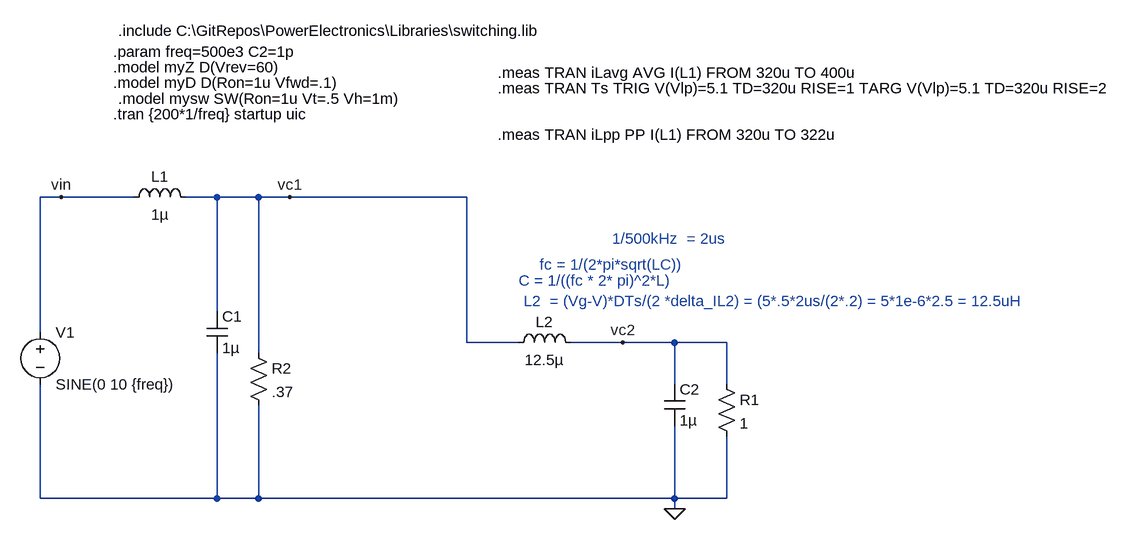
[diagram p0: schematic problem2-9_2.asc]
problem2-9_2.asc, the LTspice schematic file:
Version 4
SHEET 1 1140 724
WIRE -544 32 -576 32
WIRE -432 32 -544 32
WIRE -304 32 -352 32
WIRE -240 32 -304 32
WIRE -192 32 -240 32
WIRE 80 32 -192 32
WIRE -304 208 -304 32
WIRE -576 240 -576 32
WIRE 80 256 80 32
WIRE 160 256 80 256
WIRE 320 256 240 256
WIRE 400 256 320 256
WIRE 480 256 400 256
WIRE -240 272 -240 32
WIRE 400 320 400 256
WIRE 480 320 480 256
WIRE -576 496 -576 320
WIRE -304 496 -304 272
WIRE -304 496 -576 496
WIRE -240 496 -240 352
WIRE -240 496 -304 496
WIRE 400 496 400 384
WIRE 400 496 -240 496
WIRE 480 496 480 400
WIRE 480 496 400 496
WIRE 400 512 400 496
FLAG 400 512 0
FLAG -544 32 vin
FLAG 320 256 vc2
FLAG -192 32 vc1
SYMBOL res 464 304 R0
SYMATTR InstName R1
SYMATTR Value 1
SYMBOL ind -448 48 R270
WINDOW 0 32 56 VTop 2
WINDOW 3 5 56 VBottom 2
SYMATTR InstName L1
SYMATTR Value 1µ
SYMATTR SpiceLine Rser=1m Rpar=1Meg
SYMBOL voltage -576 224 R0
WINDOW 123 0 0 Left 0
WINDOW 39 0 0 Left 0
SYMATTR InstName V1
SYMATTR Value SINE(0 10 {freq})
SYMBOL cap 384 320 R0
SYMATTR InstName C2
SYMATTR Value 1µ
SYMBOL cap -320 208 R0
SYMATTR InstName C1
SYMATTR Value 1µ
SYMBOL ind 144 272 R270
WINDOW 0 32 56 VTop 2
WINDOW 3 5 56 VBottom 2
SYMATTR InstName L2
SYMATTR Value 12.5µ
SYMBOL res -256 256 R0
SYMATTR InstName R2
SYMATTR Value .37
TEXT -456 -120 Left 2 !.model mysw SW(Ron=1u Vt=.5 Vh=1m)
TEXT -464 -96 Left 2 !.tran {200*1/freq} startup uic
TEXT -456 -224 Left 2 !.include C:\\GitRepos\\PowerElectronics\\Libraries\\switching.lib
TEXT -464 -192 Left 2 !.param freq=500e3 C2=1p
TEXT 128 -160 Left 2 !.meas TRAN iLavg AVG I(L1) FROM 320u TO 400u
TEXT 128 -136 Left 2 !.meas TRAN Ts TRIG V(Vlp)=5.1 TD=320u RISE=1 TARG V(Vlp)=5.1 TD=320u RISE=2
TEXT 128 -64 Left 2 !.meas TRAN iLpp PP I(L1) FROM 320u TO 322u
TEXT -464 -144 Left 2 !.model myD D(Ron=1u Vfwd=.1)
TEXT 192 136 Left 2 ;fc = 1/(2*pi*sqrt(LC))
TEXT 160 160 Left 2 ;C = 1/((fc * 2* pi)^2*L)
TEXT -464 -168 Left 2 !.model myZ D(Vrev=60)
TEXT 304 96 Left 2 ;1/500kHz  = 2us
TEXT 168 192 Left 2 ;L2  = (Vg-V)*DTs/(2 *delta_IL2) = (5*.5*2us/(2*.2) = 5*1e-6*2.5 = 12.5uH

The netlist it stands for:
* problem2-9_2.asc
R1 vc2 0 1
L1 vin vc1 1µ Rser=1m Rpar=1Meg
V1 vin 0 SINE(0 10 {freq})
C2 vc2 0 1µ
C1 vc1 0 1µ
L2 vc1 vc2 12.5µ
R2 vc1 0 .37
.model mysw SW(Ron=1u Vt=.5 Vh=1m)
.tran {200*1/freq} startup uic
.include C:\GitRepos\PowerElectronics\Libraries\switching.lib
.param freq=500e3 C2=1p
.meas TRAN iLavg AVG I(L1) FROM 320u TO 400u
.meas TRAN Ts TRIG V(Vlp)=5.1 TD=320u RISE=1 TARG V(Vlp)=5.1 TD=320u RISE=2
.meas TRAN iLpp PP I(L1) FROM 320u TO 322u
.model myD D(Ron=1u Vfwd=.1)
* fc = 1/(2*pi*sqrt(LC))
* C = 1/((fc * 2* pi)^2*L)
.model myZ D(Vrev=60)
* 1/500kHz  = 2us
* L2  = (Vg-V)*DTs/(2 *delta_IL2) = (5*.5*2us/(2*.2) = 5*1e-6*2.5 = 12.5uH
.backanno
.end